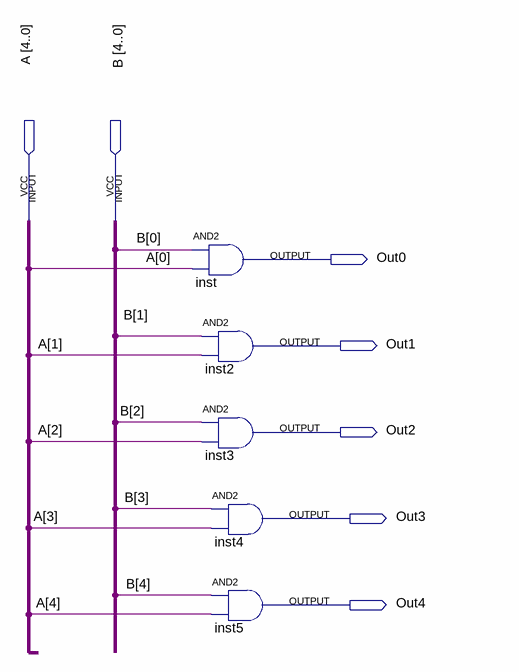
[diagram p0: schematic sheet]
// Quartus schematic AndGate.bdf as structural Verilog: 5 symbols, 7 pins
module AndGate (
  input  [4:0] A,
  input  [4:0] B,
  output Out0,
  output Out1,
  output Out2,
  output Out3,
  output Out4
);

  and inst (Out0, B[0], A[0]);
  and inst2 (Out1, B[1], A[1]);
  and inst3 (Out2, B[2], A[2]);
  and inst4 (Out3, B[3], A[3]);
  and inst5 (Out4, B[4], A[4]);
endmodule
